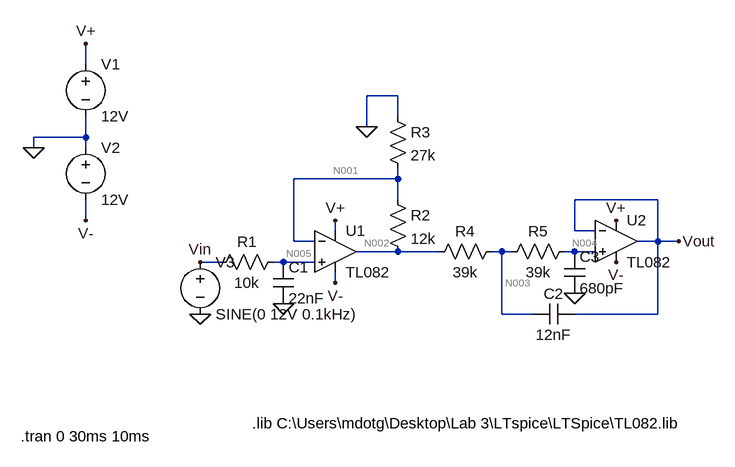
[diagram p0: schematic Transient.asc]
Transient.asc, the LTspice schematic file:
Version 4
SHEET 1 880 680
WIRE -240 -128 -240 -160
WIRE 240 -80 192 -80
WIRE 240 -48 240 -80
WIRE 192 -32 192 -80
WIRE -240 -16 -240 -48
WIRE -240 -16 -320 -16
WIRE -320 0 -320 -16
WIRE -240 0 -240 -16
WIRE 240 48 240 32
WIRE 240 48 80 48
WIRE 240 80 240 48
WIRE 640 80 512 80
WIRE -240 112 -240 80
WIRE 144 128 144 112
WIRE 512 128 512 80
WIRE 544 128 512 128
WIRE 80 144 80 48
WIRE 112 144 80 144
WIRE 640 144 640 80
WIRE 640 144 608 144
WIRE 672 144 640 144
WIRE 240 160 176 160
WIRE 304 160 240 160
WIRE 400 160 384 160
WIRE 416 160 400 160
WIRE 512 160 496 160
WIRE 544 160 512 160
WIRE -32 176 -64 176
WIRE 64 176 48 176
WIRE 112 176 64 176
WIRE 144 208 144 192
WIRE 400 256 400 160
WIRE 448 256 400 256
WIRE 640 256 640 144
WIRE 640 256 512 256
FLAG 192 -32 0
FLAG 512 224 0
FLAG 64 240 0
FLAG -320 0 0
FLAG -240 -160 V+
FLAG 144 112 V+
FLAG 576 112 V+
FLAG -240 112 V-
FLAG 576 176 V-
FLAG -64 256 0
FLAG 144 208 V-
FLAG 672 144 Vout
FLAG -64 176 Vin
SYMBOL Opamps\\opamp2 144 96 R0
SYMATTR InstName U1
SYMATTR Value TL082
SYMBOL Opamps\\opamp2 576 80 R0
SYMATTR InstName U2
SYMATTR Value TL082
SYMBOL res 64 160 R90
WINDOW 0 0 56 VBottom 2
WINDOW 3 32 56 VTop 2
SYMATTR InstName R1
SYMATTR Value 10k
SYMBOL res 224 64 R0
SYMATTR InstName R2
SYMATTR Value 12k
SYMBOL res 224 -64 R0
SYMATTR InstName R3
SYMATTR Value 27k
SYMBOL res 400 144 R90
WINDOW 0 0 56 VBottom 2
WINDOW 3 32 56 VTop 2
SYMATTR InstName R4
SYMATTR Value 39k
SYMBOL res 512 144 R90
WINDOW 0 0 56 VBottom 2
WINDOW 3 32 56 VTop 2
SYMATTR InstName R5
SYMATTR Value 39k
SYMBOL cap 48 176 R0
SYMATTR InstName C1
SYMATTR Value 22nF
SYMBOL cap 512 240 R90
WINDOW 0 0 32 VBottom 2
WINDOW 3 32 32 VTop 2
SYMATTR InstName C2
SYMATTR Value 12nF
SYMBOL cap 496 160 R0
SYMATTR InstName C3
SYMATTR Value 680pF
SYMBOL voltage -240 -144 R0
WINDOW 123 0 0 Left 0
WINDOW 39 0 0 Left 0
SYMATTR InstName V1
SYMATTR Value 12V
SYMBOL voltage -240 -16 R0
WINDOW 123 0 0 Left 0
WINDOW 39 0 0 Left 0
SYMATTR InstName V2
SYMATTR Value 12V
SYMBOL voltage -64 160 R0
WINDOW 123 0 0 Left 0
WINDOW 39 0 0 Left 0
SYMATTR InstName V3
SYMATTR Value SINE(0 12V 0.1kHz)
TEXT 16 424 Left 2 !.lib C:\\Users\\mdotg\\Desktop\\Lab 3\\LTspice\\LTSpice\\TL082.lib
TEXT -340 444 Left 2 !.tran 0 30ms 10ms

The netlist it stands for:
* Transient.asc
XU1 N005 N001 V+ V- N002 TL082  ; pins In+ In- V+ V- OUT
XU2 N004 Vout V+ V- Vout TL082  ; pins In+ In- V+ V- OUT
R1 N005 Vin 10k
R2 N001 N002 12k
R3 0 N001 27k
R4 N003 N002 39k
R5 N004 N003 39k
C1 N005 0 22nF
C2 Vout N003 12nF
C3 N004 0 680pF
V1 V+ 0 12V
V2 0 V- 12V
V3 Vin 0 SINE(0 12V 0.1kHz)
.lib C:\Users\mdotg\Desktop\Lab 3\LTspice\LTSpice\TL082.lib
.tran 0 30ms 10ms
.backanno
.end

* Results of the author's LTspice run, read from the files saved beside the schematic
* Operating Point, zero values left out:
*   V(n002) = 15.74 µV
*   V(v-) = -12 V
*   V(v+) = 12 V
*   V(n001) = 10.55 µV
*   V(n005) = -420.5 nV
*   V(vout) = 23.43 µV
*   V(n004) = 12.46 µV
*   V(n003) = 14.1 µV
*   I(R5) = -42.05 pA
*   I(R4) = -42.05 pA
*   I(R3) = -390.7 pA
*   I(R2) = -432.8 pA
*   I(R1) = -42.05 pA
*   I(V3) = -42.05 pA
*   I(V2) = -22.79 mA
*   I(V1) = -22.79 mA
*   Ix(u1:1) = 42.05 pA
*   Ix(u1:2) = 42.05 pA
*   Ix(u1:3) = 11.39 mA
*   Ix(u1:4) = -11.39 mA
*   Ix(u1:5) = -474.9 pA
*   Ix(u2:1) = 42.05 pA
*   Ix(u2:2) = 42.05 pA
*   Ix(u2:3) = 11.39 mA
*   Ix(u2:4) = -11.39 mA
*   Ix(u2:5) = -42.05 pA
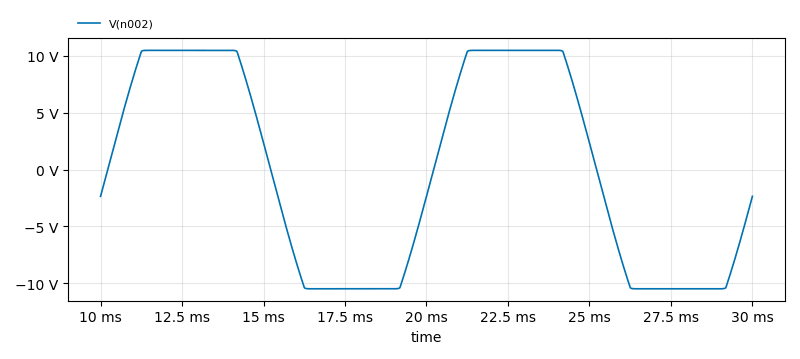
[diagram p1: Transient Analysis of Transient.asc, plotted from the saved traces]
* Transient Analysis, 1 run:
*   V(n002): min -10.48 V, max 10.48 V, average -203.5 µV, rms 8.949 V, last -2.352 V